# Altium schematic sheet Sheet1.SchDoc
size A; SheetNumber: 1; SheetTotal: 2
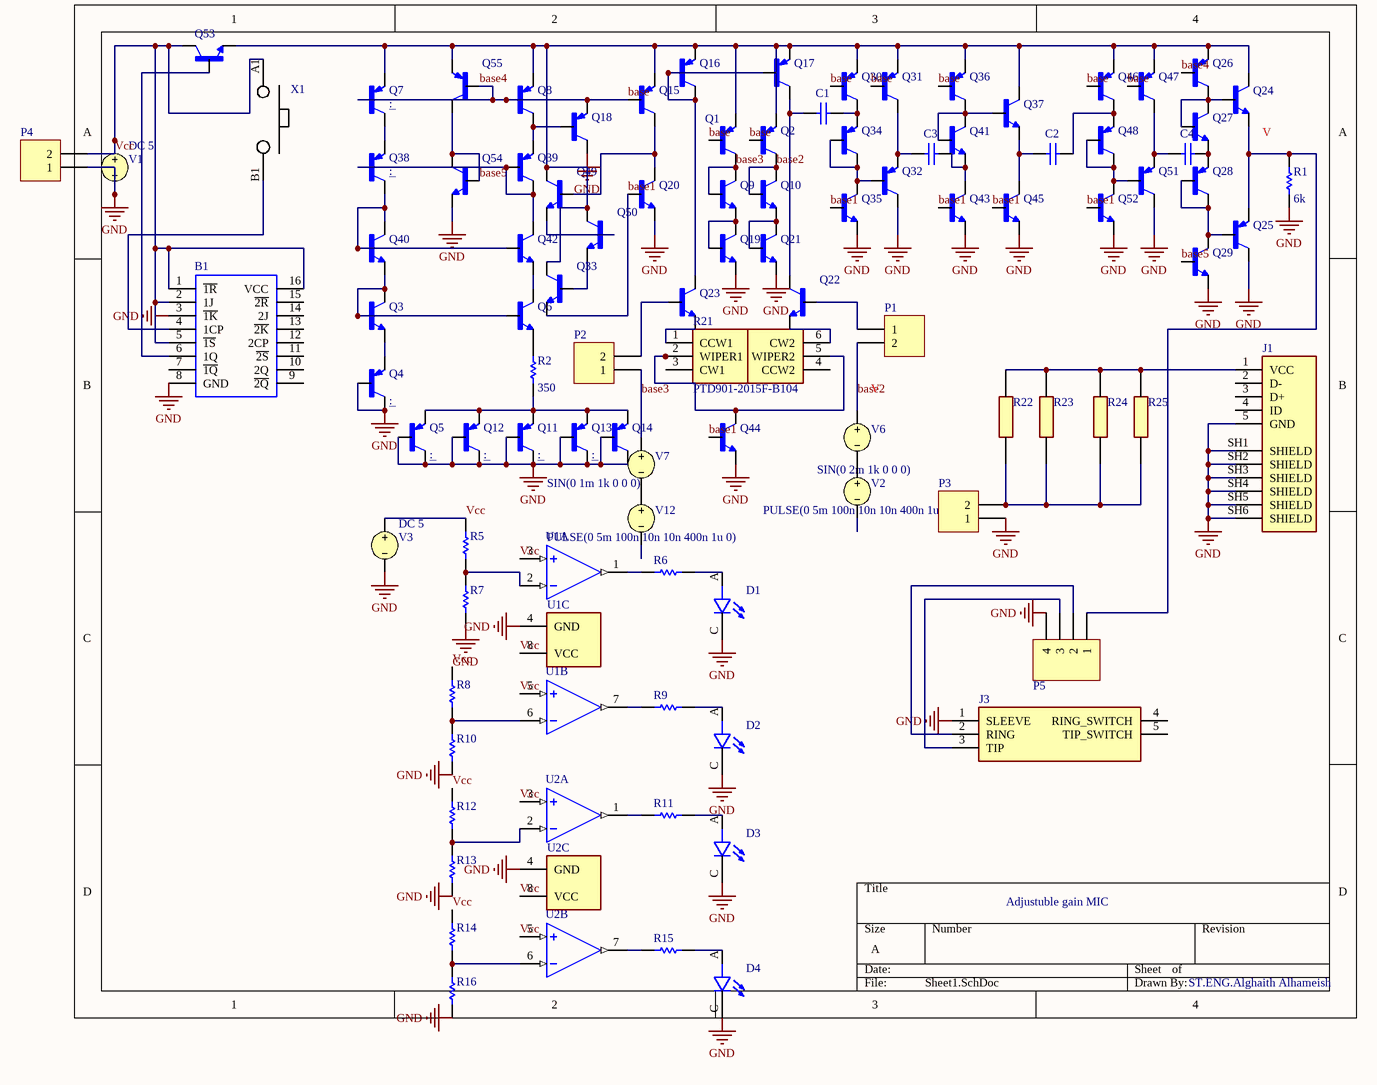
[diagram p0: Sheet1.SchDoc]

## Parts
B1  CD74HC109E  [DIP794W53P254L1930H508Q16N]  (value not drawn)
C1  Cap  [PCBComponent_1]  (value not drawn)
C2  Cap  [PCBComponent_1]  (value not drawn)
C3  Cap  [PCBComponent_1]  (value not drawn)
C4  Cap  [PCBComponent_1]  (value not drawn)
D1  151054RS03000  [LED_151054RS03000]  (value not drawn)
D2  151054RS03000  [LED_151054RS03000]  (value not drawn)
D3  151054RS03000  [LED_151054RS03000]  (value not drawn)
D4  151054RS03000  [LED_151054RS03000]  (value not drawn)
J1  1932788-1  [TE_1932788-1]  (value not drawn)
J3  35RASMT4BHNTRX  [35RASMT4BHNTRX]  (value not drawn)
P1  Header 2  [HDR1X2]  (value not drawn)
P2  Header 2  [HDR1X2]  (value not drawn)
P3  Header 2  [HDR1X2]  (value not drawn)
P4  Header 2  [HDR1X2]  (value not drawn)
P5  Header 4  [HDR1X4]  (value not drawn)
Q1  BC557BRL1G  [TO127P254X732-3]  (value not drawn)
Q2  BC557BRL1G  [TO127P254X732-3]  (value not drawn)
Q3  BC337-40_A1G  [TO127P254X732-3]  (value not drawn)
Q4  BC557BRL1G  [TO127P254X732-3]  (value not drawn)
Q5  BC557BRL1G  [TO127P254X732-3]  (value not drawn)
Q6  BC337-40_A1G  [TO127P254X732-3]  (value not drawn)
Q7  BC557BRL1G  [TO127P254X732-3]  (value not drawn)
Q8  BC557BRL1G  [TO127P254X732-3]  (value not drawn)
Q9  BC337-40_A1G  [TO127P254X732-3]  (value not drawn)
Q10  BC337-40_A1G  [TO127P254X732-3]  (value not drawn)
Q11  BC557BRL1G  [TO127P254X732-3]  (value not drawn)
Q12  BC557BRL1G  [TO127P254X732-3]  (value not drawn)
Q13  BC557BRL1G  [TO127P254X732-3]  (value not drawn)
Q14  BC557BRL1G  [TO127P254X732-3]  (value not drawn)
Q15  BC557BRL1G  [TO127P254X732-3]  (value not drawn)
Q16  2n3906  [TO127P254X732-3]  (value not drawn)
Q17  2n3906  [TO127P254X732-3]  (value not drawn)
Q18  BC557BRL1G  [TO127P254X732-3]  (value not drawn)
Q19  BC337-40_A1G  [TO127P254X732-3]  (value not drawn)
Q20  BC337-40_A1G  [TO127P254X732-3]  (value not drawn)
Q21  BC337-40_A1G  [TO127P254X732-3]  (value not drawn)
Q22  2n2222  [TO127P254X732-3]  (value not drawn)
Q23  2n2222  [TO127P254X732-3]  (value not drawn)
Q24  2n2222  [TO127P254X732-3]  (value not drawn)
Q25  2n3906  [TO127P254X732-3]  (value not drawn)
Q26  2n3906  [TO127P254X732-3]  (value not drawn)
Q27  2n2222  [TO127P254X732-3]  (value not drawn)
Q28  2n3906  [TO127P254X732-3]  (value not drawn)
Q29  2n2222  [TO127P254X732-3]  (value not drawn)
Q30  BC557BRL1G  [TO127P254X732-3]  (value not drawn)
Q31  BC557BRL1G  [TO127P254X732-3]  (value not drawn)
Q32  BC557BRL1G  [TO127P254X732-3]  (value not drawn)
Q33  BC337-40_A1G  [TO127P254X732-3]  (value not drawn)
Q34  BC557BRL1G  [TO127P254X732-3]  (value not drawn)
Q35  BC337-40_A1G  [TO127P254X732-3]  (value not drawn)
Q36  BC557BRL1G  [TO127P254X732-3]  (value not drawn)
Q37  BC337-40_A1G  [TO127P254X732-3]  (value not drawn)
Q38  BC557BRL1G  [TO127P254X732-3]  (value not drawn)
Q39  BC557BRL1G  [TO127P254X732-3]  (value not drawn)
Q40  BC337-40_A1G  [TO127P254X732-3]  (value not drawn)
Q41  BC337-40_A1G  [TO127P254X732-3]  (value not drawn)
Q42  BC337-40_A1G  [TO127P254X732-3]  (value not drawn)
Q43  BC337-40_A1G  [TO127P254X732-3]  (value not drawn)
Q44  BC337-40_A1G  [TO127P254X732-3]  (value not drawn)
Q45  BC337-40_A1G  [TO127P254X732-3]  (value not drawn)
Q46  BC557BRL1G  [TO127P254X732-3]  (value not drawn)
Q47  BC557BRL1G  [TO127P254X732-3]  (value not drawn)
Q48  BC557BRL1G  [TO127P254X732-3]  (value not drawn)
Q49  BC337-40_A1G  [TO127P254X732-3]  (value not drawn)
Q50  BC337-40_A1G  [TO127P254X732-3]  (value not drawn)
Q51  BC557BRL1G  [TO127P254X732-3]  (value not drawn)
Q52  BC337-40_A1G  [TO127P254X732-3]  (value not drawn)
Q53  BC337-40_A1G  [TO127P254X732-3]  (value not drawn)
Q54  BC337-40_A1G  [TO127P254X732-3]  (value not drawn)
Q55  BC557BRL1G  [TO127P254X732-3]  (value not drawn)
R1  value 6k  [AXIAL-0.3]  (hidden comment: Res1)
R2  value 350  [AXIAL-0.3]  (hidden comment: Res1)
R5  Res1  [AXIAL-0.3]  (value not drawn)
R6  Res1  [AXIAL-0.3]  (value not drawn)
R7  Res1  [AXIAL-0.3]  (value not drawn)
R8  Res1  [AXIAL-0.3]  (value not drawn)
R9  Res1  [AXIAL-0.3]  (value not drawn)
R10  Res1  [AXIAL-0.3]  (value not drawn)
R11  Res1  [AXIAL-0.3]  (value not drawn)
R12  Res1  [AXIAL-0.3]  (value not drawn)
R13  Res1  [AXIAL-0.3]  (value not drawn)
R14  Res1  [AXIAL-0.3]  (value not drawn)
R15  Res1  [AXIAL-0.3]  (value not drawn)
R16  Res1  [AXIAL-0.3]  (value not drawn)
R21  PTD901-2015F-B104  [PTD9012015FB104]
R22  MCKNP02SJ0200A10  [RESAD3200W75L1200D500]  (value not drawn)
R23  MCKNP02SJ0200A10  [RESAD3200W75L1200D500]  (value not drawn)
R24  MCKNP02SJ0200A10  [RESAD3200W75L1200D500]  (value not drawn)
R25  MCKNP02SJ0200A10  [RESAD3200W75L1200D500]  (value not drawn)
U1  LM358PE4  [DIP794W45P254L959H508Q8]  (value not drawn)  (parts A,B,C of 3)
U2  LM358PE4  [DIP794W45P254L959H508Q8]  (value not drawn)  (parts A,B,C of 3)
V1  DC 5
V2  PULSE(0 5m 100n 10n 10n 400n 1u 0)
V3  DC 5
V6  SIN(0 2m 1k 0 0 0)
V7  SIN(0 1m 1k 0 0 0)
V12  PULSE(0 5m 100n 10n 10n 400n 1u 0)
X1  BUTT-4  [BUTT4]  (value not drawn)

## Nets
GND: B1.3(~{1K}) B1.8(GND) D1.C D2.C D3.C D4.C J1.5(GND) J1.SH1(SHIELD) J1.SH2(SHIELD) J1.SH3(SHIELD) J1.SH4(SHIELD) J1.SH5(SHIELD) J1.SH6(SHIELD) J3.1(SLEEVE) P3.1 P4.1 P5.4 Q4.1(C) Q4.2(B) Q5.1(C) Q5.2(B) Q11.1(C) Q11.2(B) Q12.1(C) Q12.2(B) Q13.1(C) Q13.2(B) Q14.1(C) Q14.2(B) Q18.1(C) Q19.3(E) Q20.3(E) Q21.3(E) Q25.1(C) Q29.3(E) Q32.1(C) Q35.3(E) Q43.3(E) Q44.3(E) Q45.3(E) Q51.1(C) Q52.3(E) Q54.3(E) R1.1 R7.1 R10.1 R13.1 R16.1 U1.4(GND) U2.4(GND) V1.2 V3.2
base: Q1.2(B) Q2.2(B) Q7.2(B) Q8.2(B) Q15.2(B) Q18.3(E) Q26.2(B) Q30.2(B) Q31.2(B) Q36.2(B) Q46.2(B) Q47.2(B) Q55.2(B)  [also labelled base4]
base1: Q20.2(B) Q33.3(E) Q35.2(B) Q43.2(B) Q44.2(B) Q45.2(B) Q52.2(B)
base2: P1.2 Q2.1(C) Q10.1(C) Q10.2(B) V6.1
base3: P2.1 Q1.1(C) Q9.1(C) Q9.2(B) V7.1
base5: Q29.2(B) Q54.1(C) Q54.2(B) Q55.1(C)
Vcc: B1.1(~{1R}) B1.2(1J) B1.5(~{1S}) B1.16(VCC) P4.2 Q53.1(C) R5.2 R8.2 R12.2 R14.2 U1.3(+IN1) U1.5(+IN2) U1.8(VCC) U2.3(+IN1) U2.5(+IN2) U2.8(VCC) V1.1 V3.1 X1.A1
NetB1_4: B1.4(1CP) X1.B1
NetB1_6: B1.6(1Q) Q53.2(B)
NetC1_1: C1.1 Q17.1(C) Q22.1(C)
NetC1_2: C1.2 Q30.1(C) Q34.3(E)
NetC2_1: C2.1 Q37.3(E) Q45.1(C)
NetC2_2: C2.2 Q46.1(C) Q48.3(E)
NetC3_1: C3.1 Q31.1(C) Q32.3(E)
NetC3_2: C3.2 Q41.3(E) Q43.1(C)
NetC4_1: C4.1 Q47.1(C) Q51.3(E)
NetC4_2: C4.2 Q27.3(E) Q28.3(E)
NetD1_A: D1.A R6.1
NetD2_A: D2.A R9.1
NetD3_A: D3.A R11.1
NetD4_A: D4.A R15.1
NetJ1_1: J1.1(VCC) R22.2 R23.2 R24.2 R25.2
NetJ3_2: J3.2(RING) P5.2
NetJ3_3: J3.3(TIP) P5.3
NetP1_1: P1.1 Q22.2(B)
NetP2_2: P2.2 Q23.2(B)
NetP3_2: P3.2 R22.1 R23.1 R24.1 R25.1
NetP5_1: P5.1 Q24.3(E) Q25.3(E) R1.2
NetQ1_3: Q1.3(E) Q2.3(E) Q7.3(E) Q8.3(E) Q15.3(E) Q16.3(E) Q17.3(E) Q24.1(C) Q26.3(E) Q30.3(E) Q31.3(E) Q33.1(C) Q36.3(E) Q37.1(C) Q46.3(E) Q47.3(E) Q49.1(C) Q50.1(C) Q53.3(E) Q55.3(E)
NetQ3_1: Q3.1(C) Q3.2(B) Q6.2(B) Q40.3(E)
NetQ3_3: Q3.3(E) Q4.3(E)
NetQ5_3: Q5.3(E) Q11.3(E) Q12.3(E) Q13.3(E) Q14.3(E) R2.1
NetQ6_1: Q6.1(C) Q42.3(E)
NetQ6_3: Q6.3(E) R2.2
NetQ7_1: Q7.1(C) Q38.3(E)
NetQ8_1: Q8.1(C) Q18.2(B) Q39.3(E)
NetQ9_3: Q9.3(E) Q19.1(C) Q19.2(B)
NetQ10_3: Q10.3(E) Q21.1(C) Q21.2(B)
NetQ15_1: Q15.1(C) Q20.1(C) Q49.2(B)
NetQ16_1: Q16.1(C) Q16.2(B) Q17.2(B) Q23.1(C)
NetQ22_3: Q22.3(E) R21.6(CW2)
NetQ23_3: Q23.3(E) R21.1(CCW1)
NetQ24_2: Q24.2(B) Q26.1(C) Q27.1(C) Q27.2(B)
NetQ25_2: Q25.2(B) Q28.1(C) Q28.2(B) Q29.1(C)
NetQ32_2: Q32.2(B) Q34.1(C) Q34.2(B) Q35.1(C)
NetQ33_2: Q33.2(B) Q50.3(E)
NetQ36_1: Q36.1(C) Q37.2(B) Q41.1(C) Q41.2(B)
NetQ38_1: Q38.1(C) Q40.1(C) Q40.2(B) Q42.2(B)
NetQ38_2: Q38.2(B) Q39.1(C) Q39.2(B) Q42.1(C)
NetQ44_1: Q44.1(C) R21.2(WIPER1) R21.5(WIPER2)
NetQ48_1: Q48.1(C) Q48.2(B) Q51.2(B) Q52.1(C)
NetQ49_3: Q49.3(E) Q50.2(B)
NetR5_1: R5.1 R7.2 U1.2(-IN1)
NetR6_2: R6.2 U1.1(OUT1)
NetR8_1: R8.1 R10.2 U1.6(-IN2)
NetR9_2: R9.2 U1.7(OUT2)
NetR11_2: R11.2 U2.1(OUT1)
NetR12_1: R12.1 R13.2 U2.2(-IN1)
NetR14_1: R14.1 R16.2 U2.6(-IN2)
NetR15_2: R15.2 U2.7(OUT2)
NetV2_1: V2.1 V6.2
NetV7_2: V7.2 V12.1

Not connected (* = marked no-connect by the designer): B1 7(~{1Q}) 9(~{2Q}) 10(2Q) 11(~{2S}) 12(2CP) 13(~{2K}) 14(2J) 15(~{2R}); J1 2(D-) 3(D+) 4(ID); J3 4(RING_SWITCH) 5(TIP_SWITCH); R21 3(CW1) 4(CCW2); V2 2; V12 2

## Notes on the sheet
- Adjustuble gain MIC
- ST.ENG.Alghaith Alhameish

## Library data of the parts
B1 = CD74HC109E: High Speed CMOS Logic Dual Positive-Edge-Triggered J-K Flip-Flops with Set and Reset; Manufacturer_Name: Texas Instruments; Geometry.Height: 5.08mm; Mouser Part Number: 595-CD74HC109E; Mouser Price/Stock: https://www.mouser.co.uk/ProductDetail/Texas-Instruments/CD74HC109E?qs=YxwvVplHM%2Fmqq8OTpV%2FwRQ%3D%3D; Manufacturer_Part_Number: CD74HC109E; Datasheet Link: http://www.ti.com/lit/gpn/CD74HC109
C1 = Cap: Capacitor; Value: 500p; Published: 8-Jun-2000; LatestRevisionDate: 17-Jul-2002; LatestRevisionNote: Re-released for DXP Platform.; PackageReference: RAD-0.3; Publisher: Altium Limited; PackageDescription: Radial Cap, Thru-Hole; 2 Leads; 0.3 in Pin Spacing
C2-C4 = Cap: Capacitor; Value: 1uF; Published: 8-Jun-2000; LatestRevisionDate: 17-Jul-2002; LatestRevisionNote: Re-released for DXP Platform.; PackageReference: RAD-0.3; Publisher: Altium Limited; PackageDescription: Radial Cap, Thru-Hole; 2 Leads; 0.3 in Pin Spacing
D1-D4 = 151054RS03000: Red 623nm LED Indication - Discrete 1.9V Radial; Package: None; MP: 151054RS03000; Value: *; Price: None; Availability: Unavailable
J1 = 1932788-1: USB - micro B USB 2.0 Receptacle Connector 5 Position Surface Mount, Right Angle; MF: TE Connectivity; Package: None; Price: None; Check_prices: https://www.snapeda.com/parts/1932788-1/TE+Connectivity+AMP+Connectors/view-part/?ref=eda; Value: *; SnapEDA_Link: https://www.snapeda.com/parts/1932788-1/TE+Connectivity+AMP+Connectors/view-part/?ref=snap; MP: 1932788-1; Availability: In Stock; Purchase-URL: https://pricing.snapeda.com/search?q=1932788-1&ref=eda
J3 = 35RASMT4BHNTRX: Phone Connectors SMT 3.5MM PHONE JACK; Manufacturer_Name: Switchcraft; Geometry.Height: 5.127mm; Manufacturer_Part_Number: 35RASMT4BHNTRX; Mouser Part Number: 502-35RASMT4BHNTRX; Mouser Price/Stock: https://www.mouser.co.uk/ProductDetail/Switchcraft/35RASMT4BHNTRX?qs=iwvYsH9bSFa%252BoLnvLbECxQ%3D%3D; Arrow Part Number: 35RASMT4BHNTRX; Arrow Price/Stock: https://www.arrow.com/en/products/35rasmt4bhntrx/switchcraft?region=nac; Datasheet Link: https://www.arrow.com/en/products/35rasmt4bhntrx/switchcraft
P1-P4 = Header 2: Header, 2-Pin; LatestRevisionDate: 17-Jul-2002; LatestRevisionNote: Re-released for DXP Platform.; Publisher: Altium Limited
P5 = Header 4: Header, 4-Pin; LatestRevisionDate: 17-Jul-2002; LatestRevisionNote: Re-released for DXP Platform.; Publisher: Altium Limited
Q1 Q2 Q4 Q5 Q8 Q11-Q18 Q25 Q26 Q28 Q30-Q32 Q34 Q36 Q38 Q39 Q46-Q48 Q51 Q55 = BC557BRL1G: Bipolar (BJT) Transistor PNP 45V 100mA 320MHz 625mW Through Hole TO-92-3; MF: ON Semiconductor; Availability: Good; Value: *; SnapEDA_Link: https://www.snapeda.com/parts/BC557BRL1G/ON%20Semiconductor/view-part/3219064/?ref=snap; Arrow_Electronics-Purchase-URL: https://snapeda.com/shop?store=Arrow+Electronics&id=3219064; Price: None; Package: TO-92 ON Semiconductor; MP: BC557BRL1G; DigiKey-Purchase-URL: https://snapeda.com/shop?store=DigiKey&id=3219064
Q3 Q6 Q9 Q10 Q19-Q24 Q27 Q29 Q33 Q35 Q37 Q40-Q45 Q49 Q50 Q52-Q54 = BC337-40_A1G: TO-92, 50V, 0.8A, NPN Bipolar Transistor; MP: BC337-40 A1G; MF: Taiwan Semiconductor; Value: *; SnapEDA_Link: https://www.snapeda.com/parts/BC337-40%20A1G/Taiwan+Semiconductor/view-part/?ref=snap; Purchase-URL: https://pricing.snapeda.com/search/part/BC337-40 A1G/?ref=eda; Check_prices: https://www.snapeda.com/parts/BC337-40%20A1G/Taiwan+Semiconductor/view-part/?ref=eda; Availability: In Stock; Price: None; Package: TO-92 Taiwan Semiconductor
Q7 = BC557BRL1G: Bipolar (BJT) Transistor PNP 45V 100mA 320MHz 625mW Through Hole TO-92-3 Manufacturer; MF: ON Semiconductor; Availability: Good; Value: *; SnapEDA_Link: https://www.snapeda.com/parts/BC557BRL1G/ON%20Semiconductor/view-part/3219064/?ref=snap; Arrow_Electronics-Purchase-URL: https://snapeda.com/shop?store=Arrow+Electronics&id=3219064; Price: None; Package: TO-92 ON Semiconductor; MP: BC557BRL1G; DigiKey-Purchase-URL: https://snapeda.com/shop?store=DigiKey&id=3219064
R1 R2 = Res1: Resistor; Published: 8-Jun-2000; LatestRevisionDate: 17-Jul-2002; LatestRevisionNote: Re-released for DXP Platform.; PackageReference: AXIAL-0.3; Publisher: Altium Limited; PackageDescription: Axial Device, Thru-Hole; 2 Leads; 0.3 in Pin Spacing
R5 = Res1: Resistor; Value: 196; Published: 8-Jun-2000; LatestRevisionDate: 17-Jul-2002; LatestRevisionNote: Re-released for DXP Platform.; PackageReference: AXIAL-0.3; Publisher: Altium Limited; PackageDescription: Axial Device, Thru-Hole; 2 Leads; 0.3 in Pin Spacing
R6 R9 R11 R15 = Res1: Resistor; Value: 1k; Published: 8-Jun-2000; LatestRevisionDate: 17-Jul-2002; LatestRevisionNote: Re-released for DXP Platform.; PackageReference: AXIAL-0.3; Publisher: Altium Limited; PackageDescription: Axial Device, Thru-Hole; 2 Leads; 0.3 in Pin Spacing
R7 = Res1: Resistor; Value: 10k; Published: 8-Jun-2000; LatestRevisionDate: 17-Jul-2002; LatestRevisionNote: Re-released for DXP Platform.; PackageReference: AXIAL-0.3; Publisher: Altium Limited; PackageDescription: Axial Device, Thru-Hole; 2 Leads; 0.3 in Pin Spacing
R8 = Res1: Resistor; Value: 500; Published: 8-Jun-2000; LatestRevisionDate: 17-Jul-2002; LatestRevisionNote: Re-released for DXP Platform.; PackageReference: AXIAL-0.3; Publisher: Altium Limited; PackageDescription: Axial Device, Thru-Hole; 2 Leads; 0.3 in Pin Spacing
R10 = Res1: Resistor; Value: 25k; Published: 8-Jun-2000; LatestRevisionDate: 17-Jul-2002; LatestRevisionNote: Re-released for DXP Platform.; PackageReference: AXIAL-0.3; Publisher: Altium Limited; PackageDescription: Axial Device, Thru-Hole; 2 Leads; 0.3 in Pin Spacing
R12 = Res1: Resistor; Value: 1020; Published: 8-Jun-2000; LatestRevisionDate: 17-Jul-2002; LatestRevisionNote: Re-released for DXP Platform.; PackageReference: AXIAL-0.3; Publisher: Altium Limited; PackageDescription: Axial Device, Thru-Hole; 2 Leads; 0.3 in Pin Spacing
R13 = Res1: Resistor; Value: 50k; Published: 8-Jun-2000; LatestRevisionDate: 17-Jul-2002; LatestRevisionNote: Re-released for DXP Platform.; PackageReference: AXIAL-0.3; Publisher: Altium Limited; PackageDescription: Axial Device, Thru-Hole; 2 Leads; 0.3 in Pin Spacing
R14 = Res1: Resistor; Value: 10.4k; Published: 8-Jun-2000; LatestRevisionDate: 17-Jul-2002; LatestRevisionNote: Re-released for DXP Platform.; PackageReference: AXIAL-0.3; Publisher: Altium Limited; PackageDescription: Axial Device, Thru-Hole; 2 Leads; 0.3 in Pin Spacing
R16 = Res1: Resistor; Value: 500k; Published: 8-Jun-2000; LatestRevisionDate: 17-Jul-2002; LatestRevisionNote: Re-released for DXP Platform.; PackageReference: AXIAL-0.3; Publisher: Altium Limited; PackageDescription: Axial Device, Thru-Hole; 2 Leads; 0.3 in Pin Spacing
R21 = PTD901-2015F-B104: Potentiometers PANEL CONTROL 9MM-ST-CARBON; Manufacturer_Name: Bourns; Geometry.Height: 11.9mm; Manufacturer_Part_Number: PTD901-2015F-B104; Mouser Part Number: 652-PTD9012015FB104; Mouser Price/Stock: https://www.mouser.co.uk/ProductDetail/Bourns/PTD901-2015F-B104/?qs=%2FxQVPCMPNzjT537flibtBg%3D%3D; Arrow Part Number: *; Arrow Price/Stock: *; Datasheet Link: https://componentsearchengine.com/Datasheets/1/PTD901-2015F-B104.pdf
R22-R25 = MCKNP02SJ0200A10: MULTICOMP - MCKNP02SJ0200A10 - RESISTOR, WIREWOUND, 20R, 5%, 2WS; Manufacturer_Name: MULTICOMP; Manufacturer_Part_Number: MCKNP02SJ0200A10; Mouser Part Number: *; Mouser Price/Stock: *; Arrow Part Number: *; Arrow Price/Stock: *; Datasheet Link: http://www.farnell.com/datasheets/1447692.pdf
U1 U2 = LM358PE4: Dual, 30-V, 700-kHz operational amplifier; MF: Texas Instruments; Check_prices: https://www.snapeda.com/parts/LM358PE4/Texas+Instruments/view-part/?ref=eda; Price: None; MP: LM358PE4; SnapEDA_Link: https://www.snapeda.com/parts/LM358PE4/Texas+Instruments/view-part/?ref=snap; Availability: In Stock; Value: *; Purchase-URL: https://pricing.snapeda.com/search/part/LM358PE4/?ref=eda; Package: PDIP-8 Texas
V1 V3 = VSRC: Voltage Source; Note: PCB Footprint - Not required; AC Magnitude: 1; AC Phase: 0; Value: 5; Published: 8-Jun-2000; LatestRevisionDate: 17-Jul-2002; LatestRevisionNote: Re-released for DXP Platform.; PackageReference: Not Applicable; Publisher: Altium Limited
V2 V6 V7 V12 = VSRC: Voltage Source; Note: PCB Footprint - Not required; AC Magnitude: 0; Published: 8-Jun-2000; LatestRevisionDate: 17-Jul-2002; LatestRevisionNote: Re-released for DXP Platform.; PackageReference: Not Applicable; Publisher: Altium Limited; AC Phase: 0; DC Magnitude: 0; Phase: 0
  V2 V12: Initial Value: 0; Pulsed Value: 5m; Time Delay: 100n; Rise Time: 10n; Fall Time: 10n; Pulse Width: 400n; Period: 1u
  V6: Offset: 0; Frequency: 1k; Delay: 0; Damping Factor: 0; Amplitude: 2m
  V7: Offset: 0; Frequency: 1k; Delay: 0; Damping Factor: 0; Amplitude: 1m
X1 = BUTT-4: Tactile Switches MINI PUSH BUTTON SWITCH 4-PIN QTY. 4; Manufacturer_Name: Gravitech; Geometry.Height: 9.5mm; Mouser Part Number: 992-BUTT-4; Mouser Price/Stock: https://www.mouser.co.uk/ProductDetail/Gravitech/BUTT-4?qs=Vxac6xGyzPm51iLpy8GNew%3D%3D; Manufacturer_Part_Number: BUTT-4; Datasheet Link: http://site.gravitech.us/Components/BUTT-4/BUTT-4_datasheet.pdf